# Altium project BaseBoardV2.3.PrjPCB
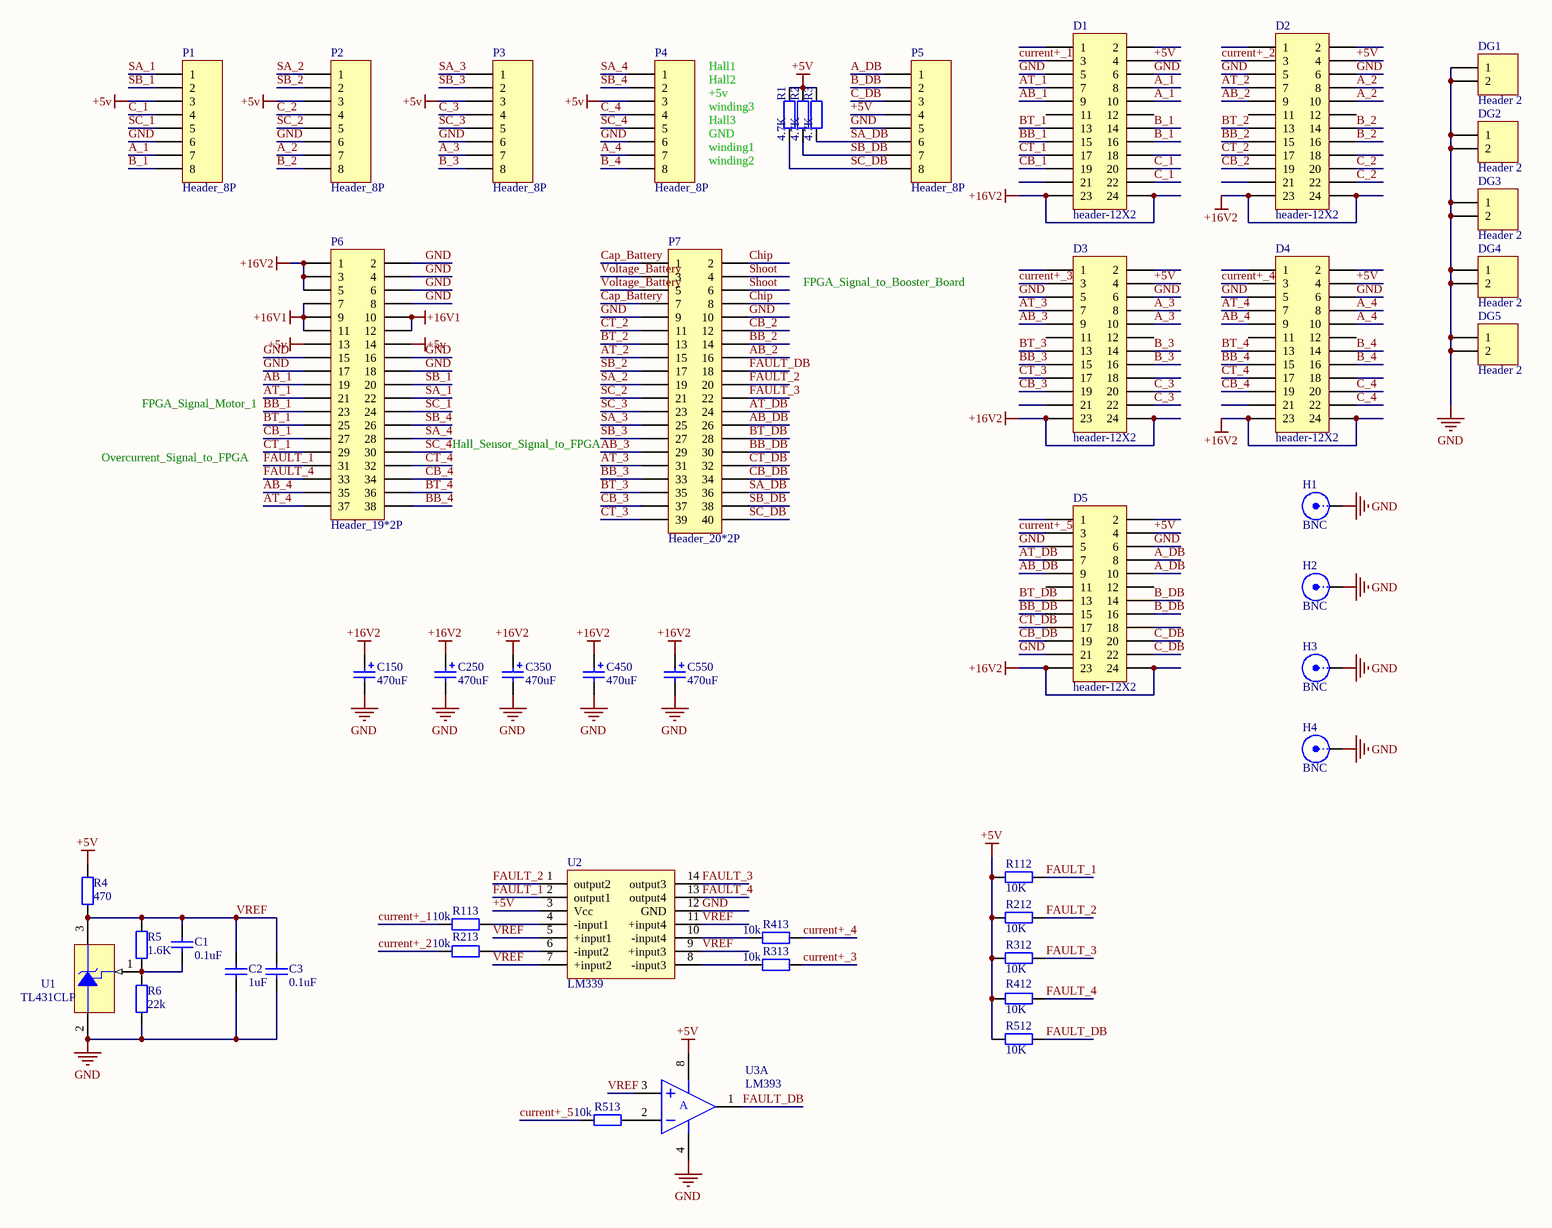
[diagram p0: BaseBoardV2.3.SchDoc]
1 sheet, 48 parts. Net scope: global (net labels, ports and power ports of the same name join across sheets).
Board file: BaseBoardV2.3.PcbDoc

## Sheet BaseBoardV2.3.SchDoc
size A3

### Parts
C1  0.1uF  [0805]
C2  1uF  [0805]
C3  0.1uF  [0805]
C150  470uF  [Cap - duplicate1]
C250  470uF  [Cap - duplicate1]
C350  470uF  [Cap - duplicate1]
C450  470uF  [Cap - duplicate1]
C550  470uF  [Cap - duplicate1]
D1  header-12X2  [Header-12X2-wgj]
D2  header-12X2  [Header-12X2-wgj]
D3  header-12X2  [Header-12X2-wgj]
D4  header-12X2  [Header-12X2-wgj]
D5  header-12X2  [Header-12X2-wgj]
DG1  Header 2  [HDR1X2]
DG2  Header 2  [HDR1X2]
DG3  Header 2  [HDR1X2]
DG4  Header 2  [HDR1X2]
DG5  Header 2  [HDR1X2]
H1  BNC  [BNC]
H2  BNC  [BNC]
H3  BNC  [BNC]
H4  BNC  [BNC]
P1  Header_8P  [Header_8P]
P2  Header_8P  [Header_8P]
P3  Header_8P  [Header_8P]
P4  Header_8P  [Header_8P]
P5  Header_8P  [Header_8P]
P6  Header_19*2P  [Header_19*2P]
P7  Header_20*2P  [Header_20*2P]
R1  4.7K  [0805]
R2  4.7K  [0805]
R3  4.7K  [0805]
R4  470  [0805]
R5  1.6K  [0805]
R6  22k  [0805]
R112  10K  [0805]
R113  10k  [0805]
R212  10K  [0805]
R213  10k  [0805]
R312  10K  [0805]
R313  10k  [0805]
R412  10K  [0805]
R413  10k  [0805]
R512  10K  [0805]
R513  10k  [0805]
U1  TL431CLP  [SOT89]
U2  LM339  [SOP14]
U3  LM393  [LM393]  (part A of 2)

### Nets
+5V: D1.4 D2.4 D3.4 D4.4 D5.4 P1.3 P2.3 P3.3 P4.3 P5.4 P6.13 P6.14 R1.1 R2.1 R3.1 R4.2 R112.2 R212.2 R312.2 R412.2 R512.2 U2.3(Vcc) U3.8(V+)
+16V1: P6.7 P6.9 P6.10 P6.11 P6.12
+16V2: C150.1 C250.1 C350.1 C450.1 C550.1 D1.23 D1.24 D2.23 D2.24 D3.23 D3.24 D4.23 D4.24 D5.23 D5.24 P6.1 P6.3 P6.5
GND: C2.1 C3.1 C150.2 C250.2 C350.2 C450.2 C550.2 D1.5 D1.6 D2.5 D2.6 D3.5 D3.6 D4.5 D4.6 D5.5 D5.6 D5.21 DG1.1 DG1.2 DG2.1 DG2.2 DG3.1 DG3.2 DG4.1 DG4.2 DG5.1 DG5.2 H1.1(X) H2.1(X) H3.1(X) H4.1(X) P1.6 P2.6 P3.6 P4.6 P5.5 P6.2 P6.4 P6.6 P6.8 P6.15 P6.16 P6.17 P6.18 P7.9 P7.10 R6.1 U1.2(A) U2.12(GND) U3.4(V-)
A_1: D1.8 D1.10 P1.7
A_2: D2.8 D2.10 P2.7
A_3: D3.8 D3.10 P3.7
A_4: D4.8 D4.10 P4.7
A_DB: D5.8 D5.10 P5.1
AB_1: D1.9 P6.19
AB_2: D2.9 P7.16
AB_3: D3.9 P7.29
AB_4: D4.9 P6.35
AB_DB: D5.9 P7.26
AT_1: D1.7 P6.21
AT_2: D2.7 P7.15
AT_3: D3.7 P7.31
AT_4: D4.7 P6.37
AT_DB: D5.7 P7.24
B_1: D1.14 D1.16 P1.8
B_2: D2.14 D2.16 P2.8
B_3: D3.14 D3.16 P3.8
B_4: D4.14 D4.16 P4.8
B_DB: D5.14 D5.16 P5.2
BB_1: D1.15 P6.23
BB_2: D2.15 P7.14
BB_3: D3.15 P7.33
BB_4: D4.15 P6.38
BB_DB: D5.15 P7.30
BT_1: D1.13 P6.25
BT_2: D2.13 P7.13
BT_3: D3.13 P7.35
BT_4: D4.13 P6.36
BT_DB: D5.13 P7.28
C_1: D1.20 D1.22 P1.4
C_2: D2.20 D2.22 P2.4
C_3: D3.20 D3.22 P3.4
C_4: D4.20 D4.22 P4.4
C_DB: D5.20 D5.22 P5.3
Cap_Battery: P7.1 P7.7
CB_1: D1.19 P6.27
CB_2: D2.19 P7.12
CB_3: D3.19 P7.37
CB_4: D4.19 P6.34
CB_DB: D5.19 P7.34
Chip: P7.2 P7.8
CT_1: D1.17 P6.29
CT_2: D2.17 P7.11
CT_3: D3.17 P7.39
CT_4: D4.17 P6.32
CT_DB: D5.17 P7.32
current+_1: D1.3 R113.1
current+_2: D2.3 R213.1
current+_3: D3.3 R313.2
current+_4: D4.3 R413.2
current+_5: D5.3 R513.1
FAULT_1: P6.31 R112.1 U2.2(output1)
FAULT_2: P7.20 R212.1 U2.1(output2)
FAULT_3: P7.22 R312.1 U2.14(output3)
FAULT_4: P6.33 R412.1 U2.13(output4)
FAULT_DB: P7.18 R512.1 U3.1(OUT)
SA_1: P1.1 P6.22
SA_2: P2.1 P7.19
SA_3: P3.1 P7.25
SA_4: P4.1 P6.28
SA_DB: P5.6 P7.36 R3.2
SB_1: P1.2 P6.20
SB_2: P2.2 P7.17
SB_3: P3.2 P7.27
SB_4: P4.2 P6.26
SB_DB: P5.7 P7.38 R2.2
SC_1: P1.5 P6.24
SC_2: P2.5 P7.21
SC_3: P3.5 P7.23
SC_4: P4.5 P6.30
SC_DB: P5.8 P7.40 R1.2
Shoot: P7.4 P7.6
Voltage_Battery: P7.3 P7.5
VREF: C1.2 C2.2 C3.2 R4.1 R5.2 U1.3(K) U2.5(+input1) U2.7(+input2) U2.9(+input3) U2.11(+input4) U3.3(IN+)
NetC1_1: C1.1 R5.1 R6.2 U1.1(REF)
NetR113_2: R113.2 U2.4(-input1)
NetR213_2: R213.2 U2.6(-input2)
NetR313_1: R313.1 U2.8(-input3)
NetR413_1: R413.1 U2.10(-input4)
NetR513_2: R513.2 U3.2(IN-)

Not connected (* = marked no-connect by the designer): D1 1 2 11 12 18 21; D2 1 2 11 12 18 21; D3 1 2 11 12 18 21; D4 1 2 11 12 18 21; D5 1 2 11 12 18

### Notes on the sheet
- Hall1
- Hall2
- Hall3
- +5v
- winding3
- GND
- winding1
- winding2
- FPGA_Signal_to_Booster_Board
- FPGA_Signal_Motor_1
- Overcurrent_Signal_to_FPGA
- Hall_Sensor_Signal_to_FPGA
- (in symbol LM393, part A) A

### Library data of the parts
C1-C3 = cap
C150 C250 C350 C450 C550 = cap-pol
DG1-DG5 = Header 2: Header, 2-Pin; LatestRevisionDate: 17-Jul-2002; LatestRevisionNote: Re-released for DXP Platform.; Publisher: Altium Limited
P1-P5 = Header_8P: Used for Motor connection in ZJUNlict
R1-R6 R112 R113 R212 R213 R312 R313 R412 R413 R512 R513 = res